# EAGLE design 221_pulse (EAGLE 9.6.2)
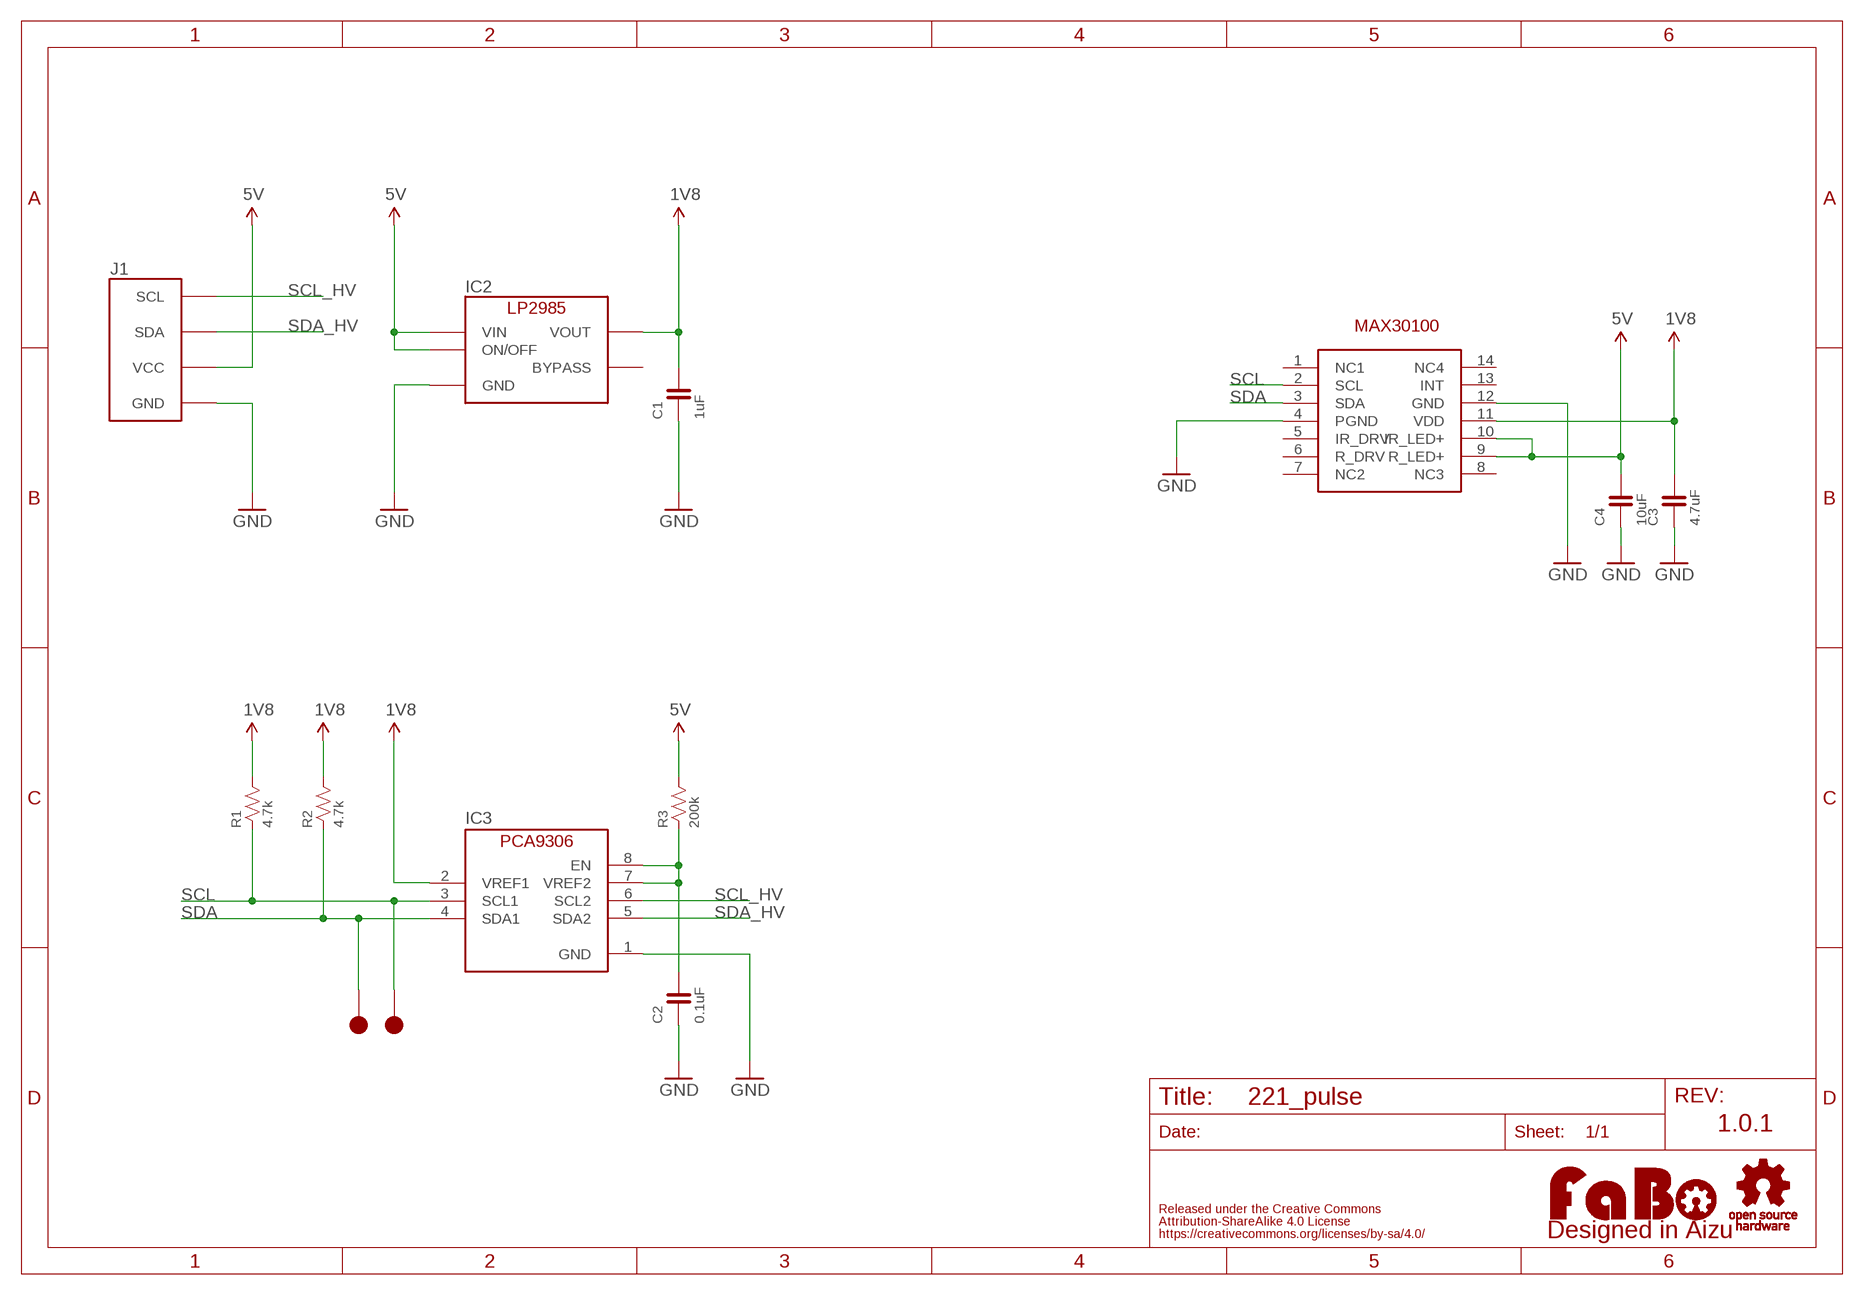
[diagram p0: schematic, sheet 1]

## Parts
C1  1uF  CAPACITOR-0603  [0603]
C2  0.1uF  CAPACITOR-0603  [0603]
C3  4.7uF  CAPACITOR-0603  [0603]
C4  10uF  CAPACITOR-0603  [0603]
IC2  LP2985-33DBV  [SOT-23-5]
IC3  PCA9306GM  [XQFN8]
J1  FABO_BRICK_I2C  [FABO_BRICK_I2C]
LOGO1  LOGO_FABO-M  [LOGO_FABO_M]
MAX30100  MA-MAX30100  [MAXIM-30100]
R1  4.7k  RESISTOR-0603  [0603]
R2  4.7k  RESISTOR-0603  [0603]
R3  200k  RESISTOR-0603  [0603]
TP1  TP-15  [TP-15]
TP2  TP-15  [TP-15]
U$2  LOGO_OSHW-M_BOTTOM  [LOGO_OSHW_M_BOTTOM]

## Nets
1V8: C1.2 C3.2 IC2.5(VOUT) IC3.2(VREF1) MAX30100.11(VDD) R1.2 R2.2
5V: C4.2 IC2.1(VIN) IC2.3(ON/OFF) J1.VCC MAX30100.9(R_LED+) MAX30100.10(IR_LED+) R3.2
GND: C1.1 C2.1 C3.1 C4.1 IC2.2(GND) IC3.1(GND) J1.GND MAX30100.4(PGND) MAX30100.12(GND)
N$1: C2.2 IC3.7(VREF2) IC3.8(EN) R3.1
SCL: IC3.3(SCL1) MAX30100.2(SCL) R1.1 TP2.1
SCL_HV: IC3.6(SCL2) J1.SCL
SDA: IC3.4(SDA1) MAX30100.3(SDA) R2.1 TP1.1
SDA_HV: IC3.5(SDA2) J1.SDA
Unconnected: IC2.4(BYPASS) MAX30100.1(NC1) MAX30100.5(IR_DRV) MAX30100.6(R_DRV) MAX30100.7(NC2) MAX30100.8(NC3) MAX30100.13(INT) MAX30100.14(NC4)

## Notes on the sheet
- 1.0.1

## Library data of the parts
C1-C4 = FaBo-Capacitor:CAPACITOR: CAPACITOR
IC2 = FaBo-Supply:LP2985: LP2985
IC3 = FaBo-LevelTranslator:PCA9306
J1 = FaBo-Template:FABO_BRICK_I2C: FaBo Brick I2C
LOGO1 = component:LOGO_FABO
MAX30100 = FaBo-Mems:MA-MAX30100
R1-R3 = FaBo-Resistors:RESISTOR: RESISTOR
TP1 TP2 = FaBo-Supply:TP
U$2 = FaBo-etc:LOGO_OSHW

## Board
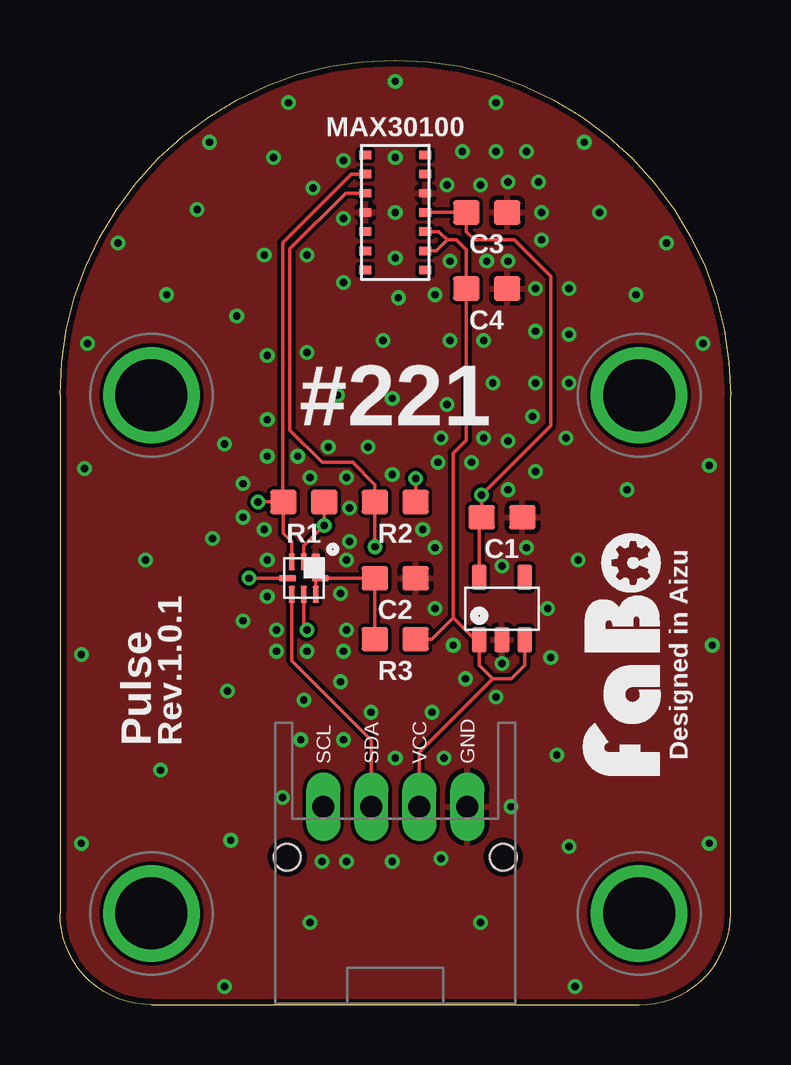
[diagram p1: board, top side]
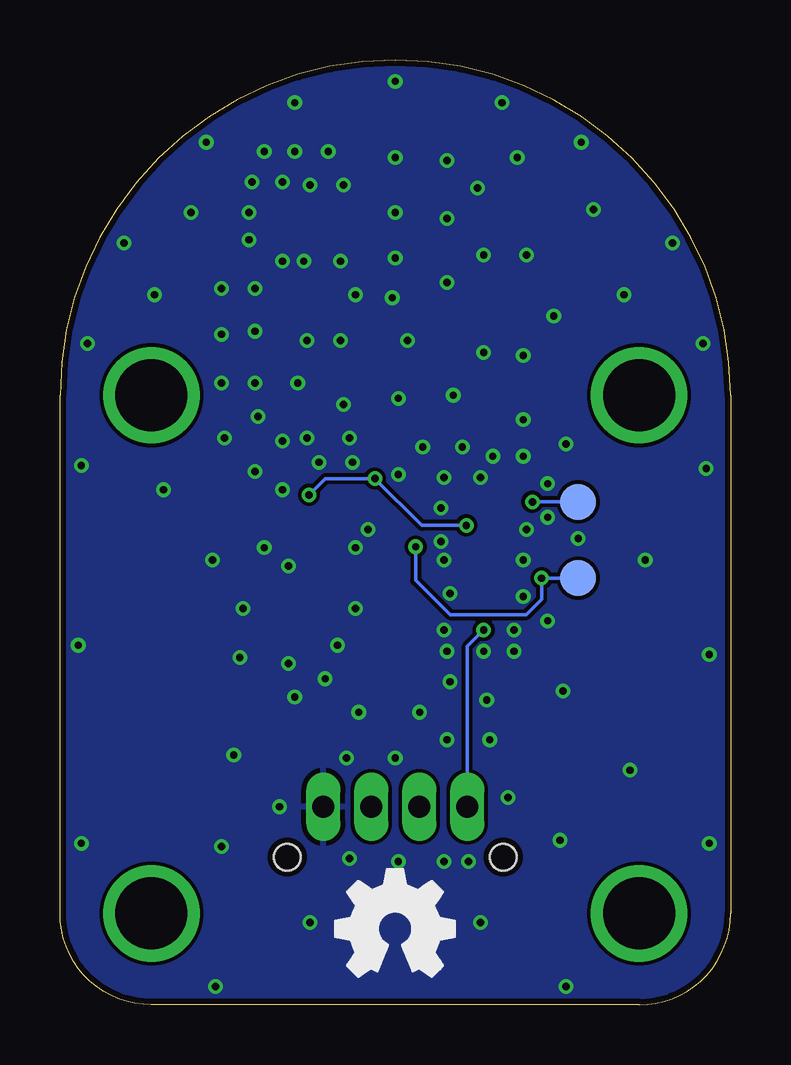
[diagram p2: board, bottom side, seen from below]

Size 27.94 x 39.37 mm. Coordinates in mm from the lower left corner, seen from the top.
Copper layers (1*16): Top 0.035mm / dielectric 1.6mm / Bottom 0.035mm
Design rules "PCBway": minimum track width 6mil, minimum drill 12mil, track to track 6mil, track to pad 6mil, pad to pad 6mil, via to via 6mil, smd to smd 6mil, copper to edge 10mil, drill to drill 10mil, minimum pad ring 10mil, minimum via ring 6mil, stop-mask expansion 2mil, vias tented up to drill 100mil, thermal gap 8mil

### Footprints (pad centres in the part's own frame; a part is rotated, then mirrored left to right if it is on the bottom)
0603 = smd 1.1 x 1: 1 -0.85,0; 2 0.85,0
SOT-23-5 = smd 0.6 x 1.05: 1 -0.95,-1.3; 2 0,-1.3; 3 0.95,-1.3; 4 0.95,1.3; 5 -0.95,1.3
XQFN8 = smd 0.7 x 0.35: 1 -0.675,0.5 | smd 0.7 x 0.25: 2 -0.675,0; 3 -0.675,-0.5; 5 0.675,-0.5; 6 0.675,0; 7 0.675,0.5 | smd 0.25 x 0.7: 4 0,-0.675; 8 0,0.675
FABO_BRICK_I2C = drill 0.9 pad 1.422 long: GND 3,-10.795; SCL -3,-10.795; SDA -1,-10.795; VCC 1,-10.795 | drill 3 pad 3.81: P$1 -10.16,6.35; P$2 10.16,6.35; P$3 -10.16,-15.24; P$4 10.16,-15.24 | hole 1.1: -4.5,-12.895; 4.5,-12.895
MAXIM-30100 = smd 0.5 x 0.35: 1 -1.25,2.4; 2 -1.25,1.6; 3 -1.25,0.8; 4 -1.25,0; 5 -1.25,-0.8; 6 -1.25,-1.6; 7 -1.25,-2.4; 8 1.25,-2.4; 9 1.25,-1.6; 10 1.25,-0.8; 11 1.25,0; 12 1.25,0.8; 13 1.25,1.6; 14 1.25,2.4
TP-15 = smd 1.5 x 1.5: 1 0,0

### Placement (x,y rotation side)
C1  18.41,20.32 180 top
C2  13.97,17.78 180 top
C3  17.78,33.02 180 top
C4  17.78,29.84 180 top
IC2  18.41,16.51 0 top
IC3  10.16,17.78 270 top
J1  13.97,19.05 0 top
LOGO1  25.4,14.61 90 top
MAX30100  13.97,33.02 0 top
R1  10.16,20.95 0 top
R2  13.97,20.95 0 top
R3  13.97,15.24 0 top
TP1  6.35,17.78 0 bottom
TP2  6.35,20.95 0 bottom
U$2  13.97,3.17 0 top

### Tracks (layer width: path | path; a pad name or v marks a point on that pad's centre or on a via)
1V8  (via drill 0.3)
  Top 0.152: MAX30100.11 C3.2 16.93,32.22 17.27,31.88 18.92,31.88 20.45,30.35 20.45,24.13 v17.57,21.25 C1.2 17.46,20.22 IC2.5 | R2.2 v14.82,21.93 | R1.2 v11.01,19.98 10.16,19.13 IC3.2
  Bottom 0.152: v11.01,19.98 12.87,19.98 v14.82,21.93 16.88,21.93 v17.57,21.25
5V
  Top 0.152: MAX30100.10 15.79,32.22 16.13,31.88 | MAX30100.9 15.67,31.42 16.13,31.88 | 16.13,31.88 16.51,31.88 16.93,31.46 C4.2 16.93,23.53 16.38,22.99 16.38,16.13 | 18.03,13.59 17.53,14.1 17.46,14.16 IC2.1 17.3,15.21 16.38,16.13 | IC2.3 19.36,14.16 18.8,13.59 18.03,13.59 | J1.VCC 14.97,10.53 18.03,13.59 | R3.2 15.49,15.24 16.38,16.13
GND  (via drill 0.3)
  other vias: 18.41,14.22 8.64,17.02 11.68,17.14 11.94,15.62 9.02,15.62 10.29,14.73 11.81,14.73 9.02,14.73 7.62,16 8.64,18.54 11.94,18.54 12.06,19.3 8.51,19.81 9.91,22.86 11.94,21.97 10.41,21.97 8.64,22.86 7.62,21.72 7.62,20.32 11.18,23.24 13.84,22.1 12.83,23.24 15.88,23.62 17.65,23.62 17.14,22.61 15.75,22.61 15.62,19.05 15.11,19.81 12.06,20.7 8.64,24.38 8.64,27.05 10.29,27.18 11.56,25.4 13.84,25.27 10.29,31.24 8.51,31.24 11.81,32.77 10.54,34.04 11.81,35.18 11.81,30.1 14.1,29.46 16.26,30.99 15.62,29.59 17.78,30.99 18.67,30.99 16.13,34.16 17.53,34.16 18.67,34.29 19.94,34.29 20.07,33.02 20.07,31.88 16.76,35.56 18.16,35.56 19.43,35.56 13.97,38.48 18.16,37.59 9.53,37.59 6.22,35.94 21.84,35.94 13.97,35.31 13.97,33.02 13.97,31.11 19.81,29.84 21.21,29.84 17.65,27.69 16.26,27.69 19.81,28.07 21.21,27.94 19.68,24.51 21.08,23.62 21.21,25.91 19.81,25.91 18.03,25.91 16.13,25.02 19.81,22.23 18.67,23.5 18.67,21.46 19.43,19.05 18.41,18.29 20.32,16.51 20.45,14.48 16.38,14.99 15.62,16.51 11.68,13.46 10.16,12.7 11.81,11.05 12.95,12.19 13.97,10.29 16.89,13.59 18.16,12.83 16,10.29 15.49,12.19 10.03,11.05 10.92,5.97 11.94,5.97 13.84,5.97 15.88,6.1 18.8,8.26 9.27,8.64 2.41,31.75 25.27,31.75 22.48,33.02 5.71,33.15 8.89,35.31 1.14,27.56 26.8,27.56 24,29.59 4.45,29.59 13.46,27.69 7.37,28.7 1.02,22.35 27.05,22.48 6.35,19.43 6.86,23.37 23.62,21.46 27.18,14.99 0.89,14.61 3.56,18.54 21.59,18.54 0.89,6.73 27.05,6.73 21.21,6.6 7.11,6.86 4.19,9.78 6.99,13.08 20.7,10.41 21.46,0.76 6.86,0.76 10.41,3.43 17.53,3.43
  pour Bottom (isolate 0.152): 0,0 27.94,0 27.94,39.37 0,39.37
  pour Top (isolate 0.152): 0,0 27.94,0 27.94,39.37 0,39.37
N$1
  Top 0.152: IC3.7 10.66,17.78 IC3.8 C2.2 R3.1
SCL  (via drill 0.3)
  Top 0.152: MAX30100.2 12.14,34.62 9.27,31.75 9.27,20.99 R1.1 | IC3.3 9.66,19.3 9.31,19.65 R1.1 | R1.1 v8.26,20.95
  Bottom 0.152: TP2.1 v8.26,20.95
SCL_HV  (via drill 0.3)
  Top 0.152: IC3.6 10.16,15.75 v10.29,15.62
  Bottom 0.152: J1.SCL 10.97,14.94 v10.29,15.62
SDA  (via drill 0.3)
  Top 0.152: MAX30100.3 11.9,33.82 9.58,31.5 9.58,23.95 10.92,22.61 12.19,22.61 13.12,21.68 R2.1 v13.12,19.09 | IC3.4 v7.87,17.78
  Bottom 0.152: TP1.1 v7.87,17.78 7.87,16.89 8.51,16.26 11.68,16.26 13.12,17.69 v13.12,19.09
SDA_HV
  Top 0.152: IC3.5 9.66,14.34 12.97,11.03 J1.SDA

### Text on the board
tPlace: #221 | Designed in Aizu | Pulse | Rev.1.0.1